# Altium schematic sheet SPE_router_top.SchDoc: SPE Router
size 420 x 297 mm; Author: P. Daniel; CompanyName: WUT ISE; DrawnBy: P. Daniel; Organization: WUT ISE; Address1: WUT ISE; Address2: Nowowiejska 15/19 00-665 Warsaw; Address3: piotrmaciejdaniel@gmail.com; Revision: 1; SheetNumber: 1; SheetTotal: 4; ModifiedBy: -; CreateDate: 02-03.2023; CheckedDate: -; Title2: top schematic; DivGrp: WUT ISE; Designer: Piotr Daniel
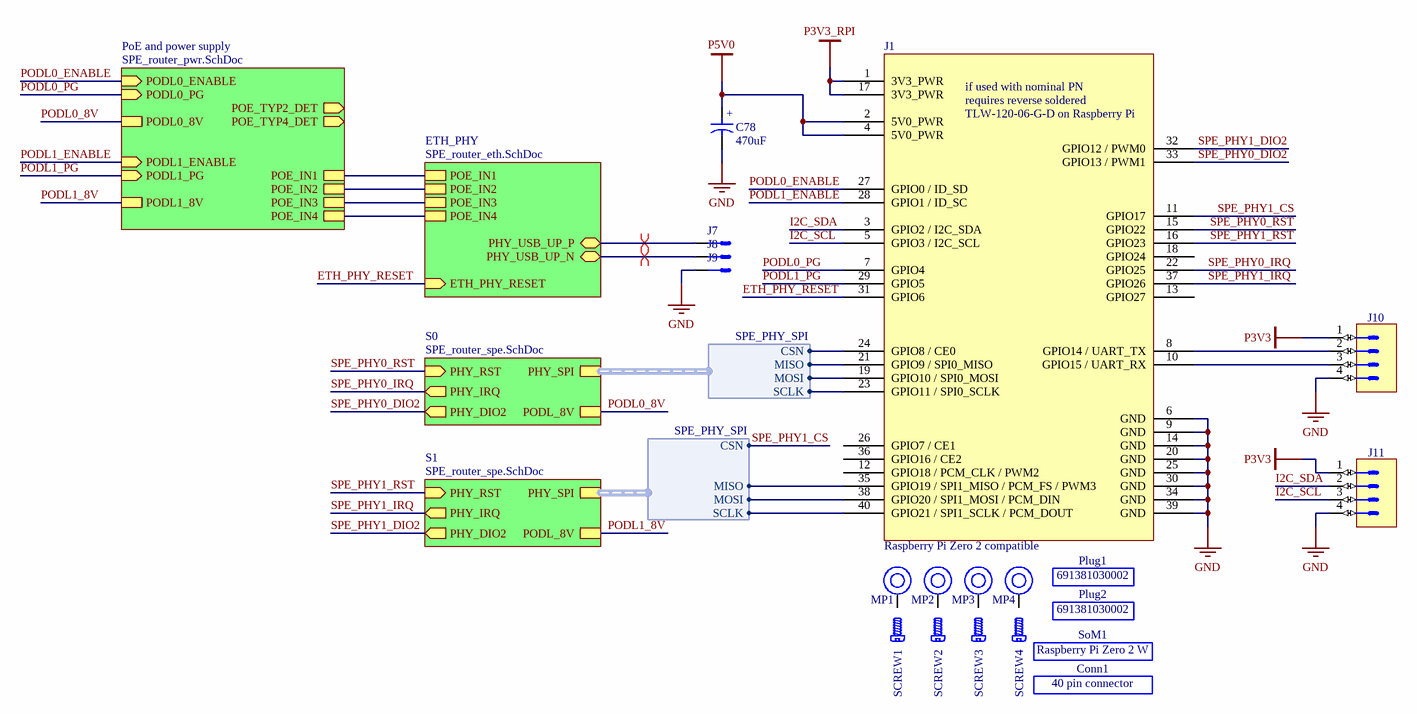
[diagram p0: SPE_router_top.SchDoc]

## Parts
C78  470uF  [CAPAE830X1020N]
Conn1  40 pin connector
J1  Raspberry Pi Zero 2 compatible  [SLW-120-01-T-D]
J7  0907-4-15-20-75-14-110  [0907-4-15-20-75-14-11-0]  (value not drawn)
J8  0907-4-15-20-75-14-110  [0907-4-15-20-75-14-11-0]  (value not drawn)
J9  0907-4-15-20-75-14-110  [0907-4-15-20-75-14-11-0]  (value not drawn)
J10  Header 4  [SAMTEC_TSW-104-07-L-S-LL]  (value not drawn)
J11  Header 4  [SAMTEC_TSW-104-07-L-S-LL]  (value not drawn)
MP1  M2.5 x 6.5mm  [9774065151]  (value not drawn)
MP2  M2.5 x 6.5mm  [9774065151]  (value not drawn)
MP3  M2.5 x 6.5mm  [9774065151]  (value not drawn)
MP4  M2.5 x 6.5mm  [9774065151]  (value not drawn)
Plug1  691381030002
Plug2  691381030002
SCREW1  RM2.5x6MM 2701  (value not drawn)  (mechanical)
SCREW2  RM2.5x6MM 2701  (value not drawn)  (mechanical)
SCREW3  RM2.5x6MM 2701  (value not drawn)  (mechanical)
SCREW4  RM2.5x6MM 2701  (value not drawn)  (mechanical)
SoM1  Raspberry Pi Zero 2 W

## Sub-sheets
ETH_PHY = SPE_router_eth.SchDoc: POE_IN1, POE_IN2, POE_IN3, POE_IN4, PHY_USB_UP_P (bidir), PHY_USB_UP_N (bidir), ETH_PHY_RESET (in)
PoE and power supply = SPE_router_pwr.SchDoc: POE_TYP4_DET (out), POE_IN1, POE_IN2, POE_IN3, POE_IN4, POE_TYP2_DET (out), PODL0_ENABLE (in), PODL1_ENABLE (in), PODL0_8V, PODL1_8V, PODL0_PG (in), PODL1_PG (in)
S0 = SPE_router_spe.SchDoc: PHY_SPI (harness SPE_PHY_SPI), PHY_RST (in), PHY_IRQ (out), PODL_8V, PHY_DIO2 (out)
S1 = SPE_router_spe.SchDoc: PHY_SPI (harness SPE_PHY_SPI), PHY_RST (in), PHY_IRQ (out), PODL_8V, PHY_DIO2 (out)

## Harnesses
SPE_PHY_SPI: CSN, SCLK, MOSI, MISO

## Nets
GND: C78.2 J1.6(GND) J1.9(GND) J1.14(GND) J1.20(GND) J1.25(GND) J1.30(GND) J1.34(GND) J1.39(GND) J9.1 J10.4 J11.4
P3V3: J10.1 J11.1
P3V3_RPI: J1.1(3V3_PWR) J1.17(3V3_PWR)
P5V0: C78.1 J1.2(5V0_PWR) J1.4(5V0_PWR)
ETH_PHY_RESET: J1.31(GPIO6) ; sheet ETH_PHY/ETH_PHY_RESET
I2C_SCL: J1.5(GPIO3_/_I2C_SCL) J11.3
I2C_SDA: J1.3(GPIO2_/_I2C_SDA) J11.2
PODL0_8V: sheet S0/PODL_8V, sheet PoE and power supply/PODL0_8V
PODL0_ENABLE: J1.27(GPIO0_/_ID_SD) ; sheet PoE and power supply/PODL0_ENABLE
PODL0_PG: J1.7(GPIO4) ; sheet PoE and power supply/PODL0_PG
PODL1_8V: sheet S1/PODL_8V, sheet PoE and power supply/PODL1_8V
PODL1_ENABLE: J1.28(GPIO1_/_ID_SC) ; sheet PoE and power supply/PODL1_ENABLE
PODL1_PG: J1.29(GPIO5) ; sheet PoE and power supply/PODL1_PG
SPE_PHY0_DIO2: J1.33(GPIO13_/_PWM1) ; sheet S0/PHY_DIO2
SPE_PHY0_IRQ: J1.22(GPIO25) ; sheet S0/PHY_IRQ
SPE_PHY0_RST: J1.15(GPIO22) ; sheet S0/PHY_RST
SPE_PHY1_CS: J1.11(GPIO17) ; sheet S1/PHY_SPI.CSN
SPE_PHY1_DIO2: J1.32(GPIO12_/_PWM0) ; sheet S1/PHY_DIO2
SPE_PHY1_IRQ: J1.37(GPIO26) ; sheet S1/PHY_IRQ
SPE_PHY1_RST: J1.16(GPIO23) ; sheet S1/PHY_RST
NetJ1_8: J1.8(GPIO14_/_UART_TX) J10.2
NetJ1_10: J1.10(GPIO15_/_UART_RX) J10.3
NetJ1_19: J1.19(GPIO10_/_SPI0_MOSI) ; sheet S0/PHY_SPI.MOSI
NetJ1_21: J1.21(GPIO9_/_SPI0_MISO) ; sheet S0/PHY_SPI.MISO
NetJ1_23: J1.23(GPIO11_/_SPI0_SCLK) ; sheet S0/PHY_SPI.SCLK
NetJ1_24: J1.24(GPIO8_/_CE0) ; sheet S0/PHY_SPI.CSN
NetJ1_35: J1.35(GPIO19_/_SPI1_MISO_/_PCM_FS_/_PWM3) ; sheet S1/PHY_SPI.MISO
NetJ1_38: J1.38(GPIO20_/_SPI1_MOSI_/_PCM_DIN) ; sheet S1/PHY_SPI.MOSI
NetJ1_40: J1.40(GPIO21_/_SPI1_SCLK_/_PCM_DOUT) ; sheet S1/PHY_SPI.SCLK
NetJ7_1: J7.1 ; sheet ETH_PHY/PHY_USB_UP_P
NetJ8_1: J8.1 ; sheet ETH_PHY/PHY_USB_UP_N
(unnamed): sheet ETH_PHY/POE_IN1, sheet PoE and power supply/POE_IN1
(unnamed): sheet ETH_PHY/POE_IN2, sheet PoE and power supply/POE_IN2
(unnamed): sheet ETH_PHY/POE_IN3, sheet PoE and power supply/POE_IN3
(unnamed): sheet ETH_PHY/POE_IN4, sheet PoE and power supply/POE_IN4

Not connected (* = marked no-connect by the designer): J1 12(GPIO18_/_PCM_CLK_/_PWM2) 13(GPIO27) 18(GPIO24) 26(GPIO7_/_CE1) 36(GPIO16_/_CE2); MP1 1; MP2 1; MP3 1; MP4 1

## Layout directives
differential pair: NetJ7_1, NetJ8_1

## Notes on the sheet
- Project/Equipment
- Document
- Designer
- Drawn by
- Check.by
- Copyright WUT ISE 2021.
  This documentation describes Open Hardware and is licensed under the CERN OHL v.1.1. You may redistribute and modify this documentation under the terms of the CERN OHL v.1.1. (http://ohwr.org/CERNOHL). This documentation is distributed WITHOUT ANY EXPRESS OR IMPLIED WARRANTY, INCLUDING OF MERCHANTABILITY, SATISFACTORY QUALITY AND FITNESS FOR A PARTICULAR PURPOSE. Please see the CERN OHL v.1.1 for applicable conditions.
- Contact
- File
- Last Mod.
- Print Date
- Sheet
- Size
- A3
- of
- Rev
- (in symbol CAE830-1020_470UF_16V_20%) +
- (in symbol SLW-120-01-T-D) if used with nominal PN; requires reverse soldered; TLW-120-06-G-D on Raspberry Pi

## Library data of the parts
C78 = CAE830-1020_470UF_16V_20%: Polarised capacitor; Part Description: Aluminum Electrolytic SMT Capacitor; Manufacturer: PANASONIC; Manufacturer Part Number: EEEFK1C471AP; Voltage: 16V; Tolerance: ±20%; Part Number: CAE830-1020_470UF_16V_20%; Component Kind: Standard; Component Type: Standard; Pin Count: 2; Value: 470uF; Status: Not Recommended; Case: F; Mounted: Yes; Socket: No; SMD: Yes; Sense: No; ComponentHeight: 10.2mm; HelpURL: \\cern.ch\dfs\Applications\Altium\Datasheets\CAE_PANASONIC_FK-V.pdf; Author: CERN DEM JLC; CreateDate: 03.12.2007; LatestRevisionDate: 05.11.2014
Conn1 = MTLW-120-06-G-D-115: Samtec MTLW-120-06-G-D-115; Manufacturer: Samtec; Manufacturer Part Number: MTLW-120-06-G-D-115
J1 = SLW-120-01-T-D: Conn Socket Strip SKT 40 POS 2.54mm Solder ST Top Entry Thru-Hole Bulk; Manufacturer: Samtec; Max Current Rating: 7.1A; Contact Resistance: 10mR; Max Voltage Rating (AC): 50V; Connector Type: Receptacle; Number of Positions: 40; Voltage Rating (AC): 550V; Row Spacing: 0.1inch; Supplier 1: Farnell; Manufacturer Part Number: SLW-120-01-T-D; RoHS: Yes; Category: Connectors; Stock 1: 10; Mount: Through Hole; Contact Plating: Tin; Contact Material: Bronze; Color: Black; Housing Color: Black; Housing Material: Polyester; Min Operating Temperature: -55°C; Max Operating Temperature: 105°C; Number of Rows: 2; Package Quantity: 1; Packaging: Bulk; Termination: Solder; Gender: Receptacle; Number of Contacts: 40; Orientation: Straight; Series: SLW; Length: 50.8mm; Width: 4.95mm; Pitch: 2.54mm; Depth: 4.95mm; Radiation Hardening: No; Reach SVHC Compliant: Yes; Lead Free: Lead Free; RoHS Compliant: Yes; ComponentLink1URL: https://datasheet.ciiva.com/413/slw-mkt-413874.pdf?src-supplier=Digi-Key; ComponentLink1Description: https://datasheet.ciiva.com/413/slw-mkt-413874.pdf?src-supplier=Digi-Key; Supplier Part Number 1: 2856554
J7-J9 = 0907-4-15-20-75-14-110: Conn, Test, Spring Terminal, Plug, Spring Loaded, Pnl Mnt, SMT Term, 1 Cont, Insulated; Manufacturer: Mill-Max; Body Material: Brass; Current Rating: 2A; Number of Contacts: 1; Supplier 1: Allied Electronics; Manufacturer Part Number: 0907-4-15-20-75-14-110; RoHS: Yes; Category: Uncategorized; Mounting Technology: Panel; Case/Package: SMD/SMT; Contact Material: Brass; Contact Plating: Gold; Number of Positions: 1; Number of Rows: 1; Termination: SMD/SMT; Length: 0.335inch; Height: 0.335inch; Reach SVHC Compliant: No; Lead Free: Lead Free; ComponentLink1URL: https://datasheet.ciiva.com/5160/015n-222786-5160785.pdf?src-supplier=Mouser; ComponentLink1Description: https://datasheet.ciiva.com/5160/015n-222786-5160785.pdf?src-supplier=Mouser; Supplier Part Number 1: 70206251
J10 J11 = SAMTEC_TSW-104-07-L-S-LL: Connector 4 Male; Part Description: 4 Contacts, Pitch 2.54mm, Single Row  Through Mount Straigh Header (Post Lead 5.84mm, Tail Lead 2.54mm, Insulator 2.54mm); Manufacturer: SAMTEC; PressFit: No; Part Number: SAMTEC_TSW-104-07-L-S-LL; Component Kind: Standard; Component Type: Standard; Pin Count: 4; Family: Header 4; Mounted: Yes; Socket: No; SMD: No; Sense: No; Status: None; Manufacturer Part Number: TSW-104-07-L-S-LL; ComponentHeight: 8.38mm; HelpURL: \\cern.ch\dfs\Applications\Altium\Datasheets\SAMTEC_TSW-104-07-L-S-LL.pdf; Author: CERN DEM MR; CreateDate: 07.12.2016; LatestRevisionDate: 07.12.2016
MP1-MP4 = 9774065151R: WA-SMSI SMT Steel Spacer with internal Thread, OD 5.1mm, M2.5 x 6.5mm; Manufacturer: Wurth Elektronik; Inside Diameter: 3.5mm; Surface: Tin; ComponentLink1Description: Website Link; ComponentLink1URL: https://www.we-online.com/redexpert/article/9774065151R?ad; ComponentLink2Description: Datasheet Link; ComponentLink2URL: https://www.we-online.com/redexpert/spec/9774065151R?ad; Manufacturer Part Number: 9774065151R; Category: SMT Spacers; Match Code: WA-SMSI; Mount: Surface Mount; Operating Temperature Max: 150°C; Operating Temperature Min: -55°C; Packaging: Tape and Reel; Height: 6.5mm; Material: Steel; Outside Diameter: 5.1mm; Thread Size: M2.5
Plug1 Plug2 = 691381030002: Wurth Elektronik 691381030002; Manufacturer: Wurth Elektronik; Manufacturer Part Number: 691381030002
SCREW1-SCREW4 = RM2.5x6MM 2701: Screw; Manufacturer: APM HEXSEAL; Manufacturer Part Number: RM2.5x6MM 2701
SoM1 = SC0510: Manufacturer: Raspberry Pi; Manufacturer Part Number: SC0510